# Altium schematic sheet SCH004.SchDoc: Communication Interface
size A4; Date: 07-02-2024; DrawnBy: Nikhil Premjani; SheetNumber: 4; SheetTotal: 6; ModelNumber: EM411-202401-RMC001; ModelName: Remote Manipulation Controller
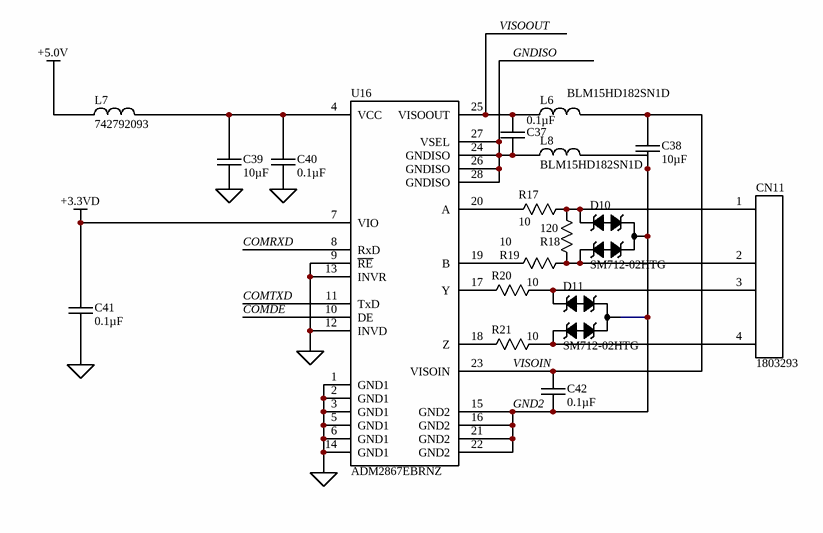
[diagram p0: SCH004.SchDoc]

## Parts
C37  0.1µF  [CAPC2012X14N]
C38  10µF  [CAPC2012X14N]
C39  10µF  [CAPC2012X14N]
C40  0.1µF  [CAPC2012X14N]
C41  0.1µF  [CAPC2012X14N]
C42  0.1µF  [CAPC2012X14N]
CN11  1803293  [PHOENIX_1803293]
D10  SM712-02HTG  [SOT95P237X112-3N]
D11  SM712-02HTG  [SOT95P237X112-3N]
L6  BLM15HD182SN1D  [INDC1005X06N]
L7  742792093  [INDC2012X11N]
L8  BLM15HD182SN1D  [INDC1005X06N]
R17  10  [RESC1608X06N]
R18  120  [RESC2012X06N]
R19  10  [RESC1608X06N]
R20  10  [RESC1608X06N]
R21  10  [RESC1608X06N]
U16  ADM2867EBRNZ  [SOP65P1030X265-28N]

## Nets
+3.3VD: C41.1 U16.7(VIO)
+5.0V: L7.1
GND: C39.2 C40.2 C41.2 U16.1(GND1) U16.2(GND1) U16.3(GND1) U16.5(GND1) U16.6(GND1) U16.9(~{RE}) U16.12(INVD) U16.13(INVR) U16.14(GND1)
COMDE: U16.10(DE)
COMRXD: U16.8(RxD)
COMTXD: U16.11(TxD)
GND2: C38.2 C42.2 D10.3 D11.3 L8.2 U16.15(GND2) U16.16(GND2) U16.21(GND2) U16.22(GND2)
GNDISO: C37.2 L8.1 U16.24(GNDISO) U16.26(GNDISO) U16.27(VSEL) U16.28(GNDISO)
VISOIN: C38.1 C42.1 L6.2 U16.23(VISOIN)
VISOOUT: C37.1 L6.1 U16.25(VISOOUT)
NetC39_1: C39.1 C40.1 L7.2 U16.4(VCC)
NetCN11_1: CN11.1 D10.1 R17.2 R18.2
NetCN11_2: CN11.2 D10.2 R18.1 R19.2
NetCN11_3: CN11.3 D11.1 R20.2
NetCN11_4: CN11.4 D11.2 R21.2
NetR17_1: R17.1 U16.20(A)
NetR19_1: R19.1 U16.19(B)
NetR20_1: R20.1 U16.17(Y)
NetR21_1: R21.1 U16.18(Z)

## Notes on the sheet
- Model Number
- Model Name
- Revision
- Title
- Date
- Sheet
- of
- File
- Drawn by

## Library data of the parts
C37 C40-C42 = UMK212B7104KGHT: 0.1µF/50V/±10% X7R Ceramic Chip Capacitor; Manufacturer: Taiyo Yuden; PartNumber: UMK212B7104KGHT
C38 C39 = CL21A106KAFN3NE: 10µF/25V 10% X5R Multi-Layer Ceramic Capacitor; Manufacturer: Samsung Electro-Mechanics; PartNumber: CL21A106KAFN3NE
CN11 = 1803293: MC 1,5/4G-3,81 Pluggable Terminal Block 4 Pos 3.81mm pitch Through Hole Header; Manufacturer: Phoenix Contact; PartNumber: 1803293
D10 D11 = SM712-02HTG: SM712 Series 600W Asymmetrical TVS Diode Array; Manufacturer: Littelfuse; PartNumber: SM712-02HTG
L6 L8 = BLM15HD182SN1D: GHz Noise Suppression Chip Ferrite Bead; Manufacturer: Murata Electronics; PartNumber: BLM15HD182SN1D
L7 = 742792093: Multilayer SMD Ferrite; Manufacturer: Wurth Elektronik; PartNumber: 742792093
R17 R19-R21 = CRCW060310R0FKEAHP: 10, 1%, 0.33W Pulse Proof, High Power Thick Film Chip Resistor; Manufacturer: Vishay Intertechnology; PartNumber: CRCW060310R0FKEAHP
R18 = CR0805-FX-1200ELF: 120, 1%, 0.125W Thick Film Chip Resistor; Manufacturer: Bourns; PartNumber: CR0805-FX-1200ELF
U16 = ADM2867EBRNZ: 5.7 kV RMS Signal and Power Isolated RS-485 Transceiver with ±15 kV IEC ESD; Manufacturer: Analog Devices, Inc.; PartNumber: ADM2867EBRNZ